# Altium schematic sheet Specificaciya_2.SchDoc
size 209 x 297 mm
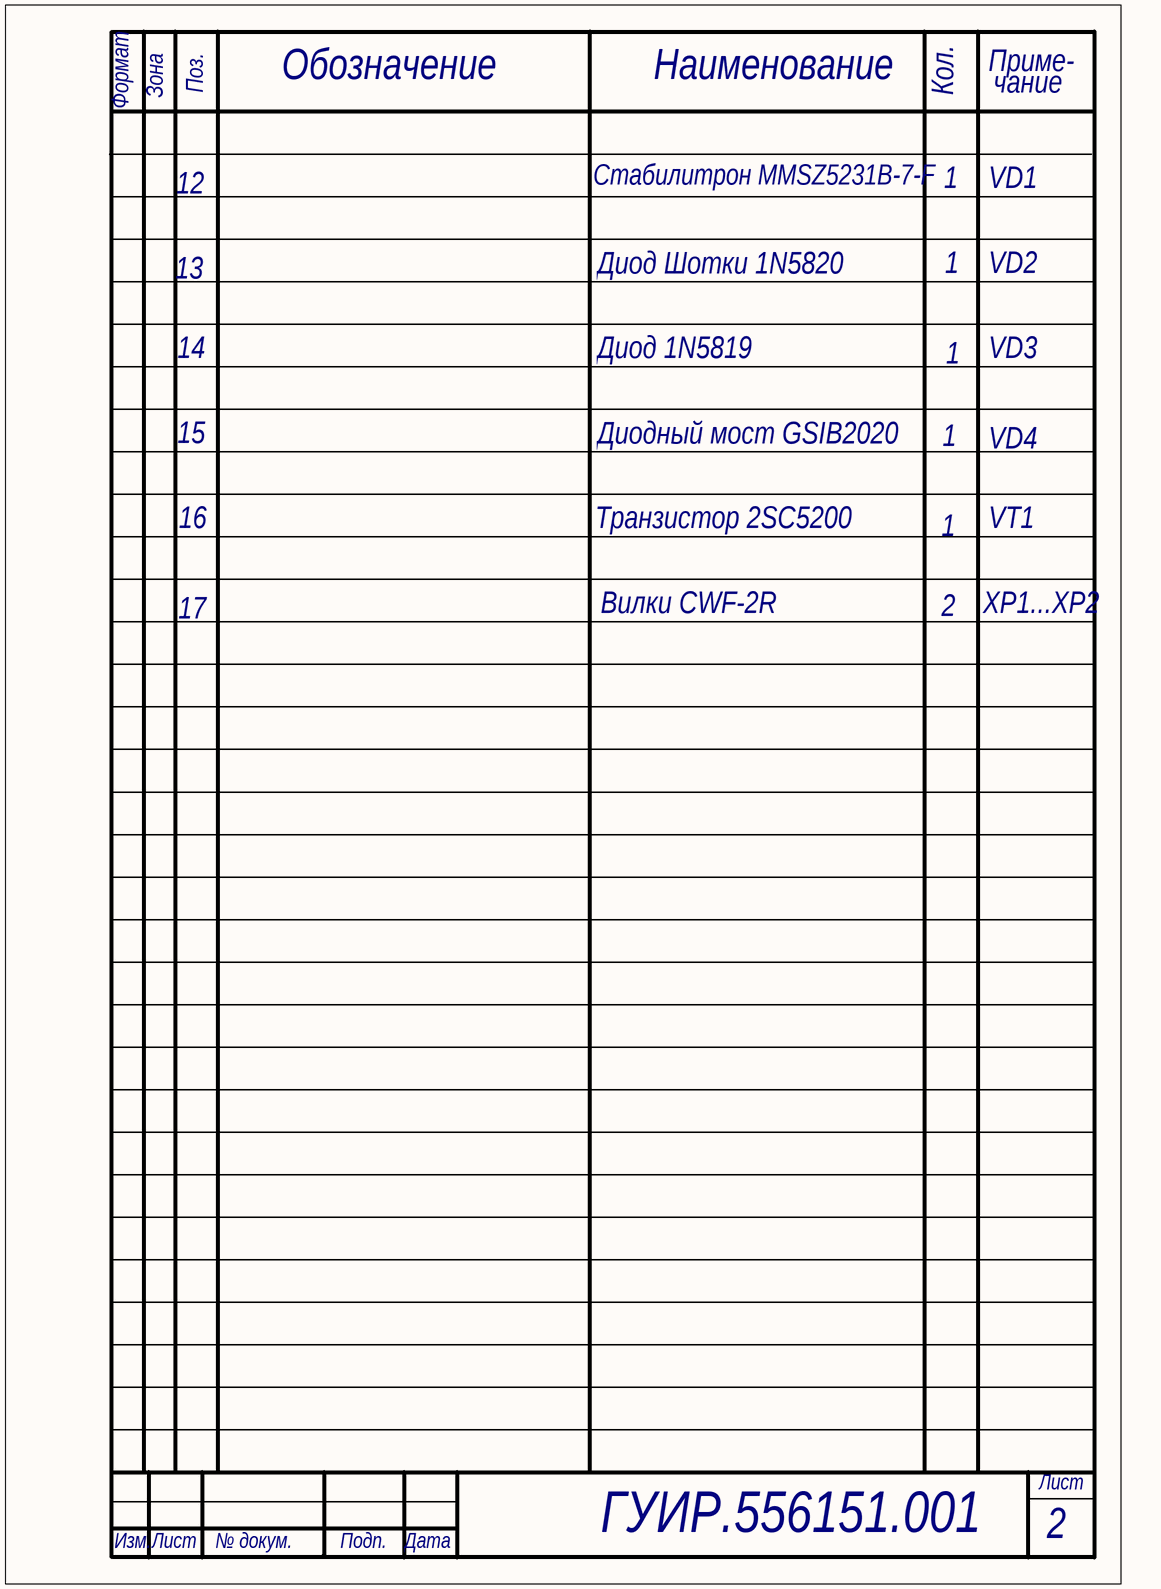
[diagram p0: Specificaciya_2.SchDoc]

## Notes on the sheet
- Формат
- Зона
- Поз.
- Обозначение
- Наименование
- Кол.
- Приме-
- чание
- Стабилитрон MMSZ5231B-7-F
- 1
- VD1
- 12
- 13
- Диод Шотки 1N5820
- VD2
- 14
- Диод 1N5819
- VD3
- 15
- Диодный мост GSIB2020
- VD4
- 16
- Транзистор 2SC5200
- VT1
- 17
- Вилки CWF-2R
- 2
- XP1...XP2
- ГУИР.556151.001
- Лист
- Изм.
- № докум.
- Подп.
- Дата